# EAGLE design D1 Breakout - LCD SMD Dupont RJ45 Logo (EAGLE 7.3.0)
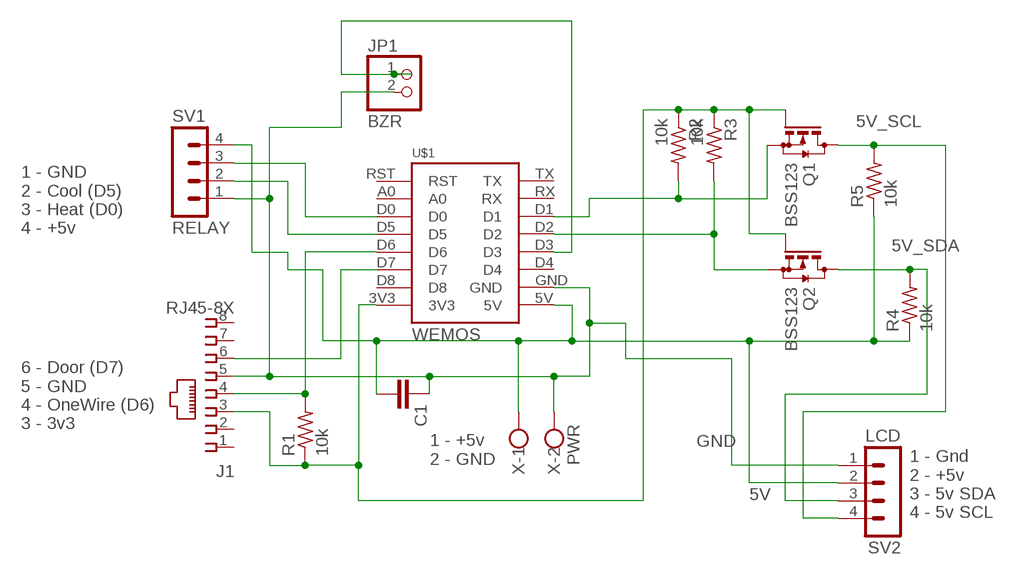
[diagram p0: schematic, sheet 1]

## Parts
C1  C-EUC1206  [C1206]
J1  RJ45-8X  [RJ45-NO-SHIELD-NOLINE]
JP1  BZR  PINHD-1X2  [1X02]
Q1  BSS123  [SOT23]
Q2  BSS123  [SOT23]
R1  10k  R-US_R0805  [R0805]
R2  10k  R-US_R0805  [R0805]
R3  10k  R-US_R0805  [R0805]
R4  10k  R-US_R0805  [R0805]
R5  10k  R-US_R0805  [R0805]
SV1  RELAY  MA04-1  [MA04-1]
SV2  LCD  MA04-1  [MA04-1]
U$1  WEMOS  [WEMOS]
X  PWR  W237-102  [W237-102]

## Nets
3V3_SCL: Q1.2(S) R2.2 U$1.D1
3V3_SDA: Q2.2(S) R3.2 U$1.D2
5V [5v]: C1.2 R4.1 R5.1 SV1.4 SV2.2 U$1.5V X.1
5V_SCL: Q1.3(D) R5.2 SV2.4
5V_SDA: Q2.3(D) R4.2 SV2.3
D6: J1.4 R1.2 U$1.D6
D7: J1.6 U$1.D7
GND [Gnd]: C1.1 J1.5 JP1.2 SV1.1 SV2.1 U$1.GND X.2
N$3 [3v]: J1.3 Q1.1(G) Q2.1(G) R1.1 R2.1 R3.1 U$1.3V3
N$6: JP1.1 U$1.D3
N$7: SV1.2 U$1.D5
N$8: SV1.3 U$1.D0
Unconnected: J1.1 J1.2 J1.7 J1.8 U$1.A0 U$1.D4 U$1.D8 U$1.RST U$1.RX U$1.TX

## Notes on the sheet
- 1 - GND
  2 - Cool (D5)
  3 - Heat (D0)
  4 - +5v
- 6 - Door (D7)
  5 - GND
  4 - OneWire (D6) 
  3 - 3v3
- 1 - +5v
  2 - GND
- 1 - Gnd
  2 - +5v
  3 - 5v SDA
  4 - 5v SCL

## Library data of the parts
C1 = resistor:C-EU: CAPACITOR, European symbol
J1 = con-tycoelectronics:RJ45: CORCOM Modular RJ Jacks No Shield Source: www.tycoelectronics.com .. ENG_DS_1654001_1099_RJ_L_0507.pdf; MPN: RJ45-8X; OC_FARNELL: unknown; OC_NEWARK: 16R6101
JP1 = pinhead:PINHD-1X2: PIN HEADER
Q1 Q2 = transistor-small-signal:BSS123: N-CHANNEL MOS FET
R1-R5 = rcl:R-US_: RESISTOR, American symbol
SV1 SV2 = con-lstb:MA04-1: PIN HEADER; OC_FARNELL: unknown; OC_NEWARK: unknown
U$1 = 1455413453956-wemos:WEMOS
X = con-wago-500:W237-102: WAGO SCREW CLAMP; MPN: 237-102; OC_FARNELL: unknown; OC_NEWARK: 70K9898

## Net classes
0 default: width 0.305 mm, clearance 0.305 mm
1 5v: width 0.406 mm, clearance 0.406 mm
2 3v: width 0.406 mm, clearance 0.406 mm
3 Gnd: width 0.406 mm, clearance 0.406 mm

## Board
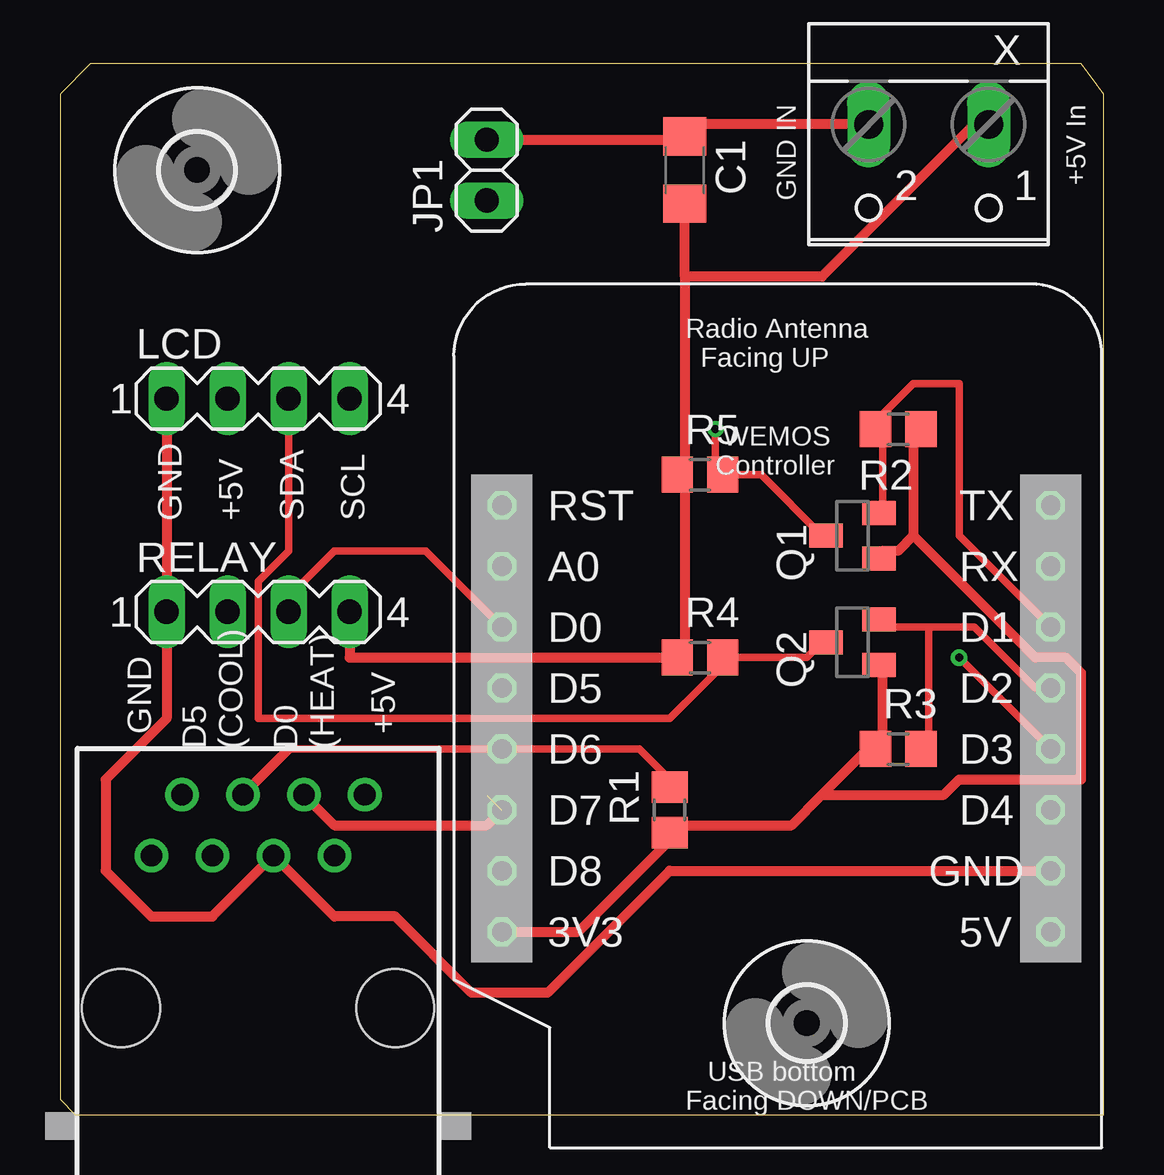
[diagram p1: board, top side]
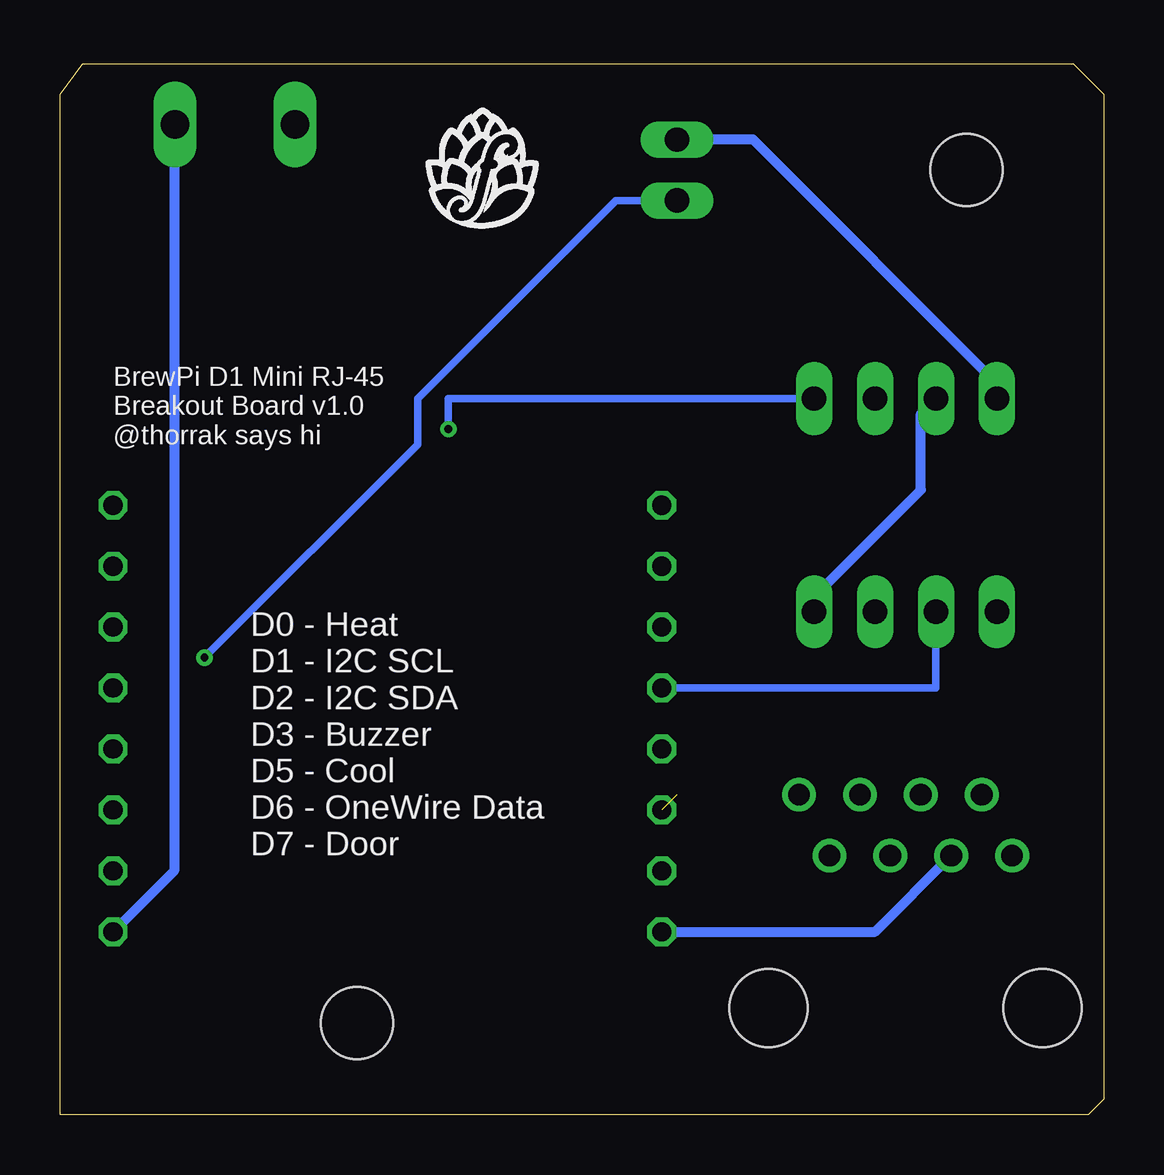
[diagram p2: board, bottom side, seen from below]

Size 43.48 x 43.81 mm. Coordinates in mm from the lower left corner, seen from the top.
Outline: 0,0.63 0.63,0 43.48,0 43.48,42.53 42.54,43.8 41.27,43.81 1.27,43.81 0,42.53 0,0.63
Copper layers (1*16): Top 0.0356mm / dielectric 1.5011mm / Bottom 0.0356mm
Design rules "PCBs_io": minimum track width 6mil, minimum drill 13mil, track to track 6mil, track to pad 6mil, pad to pad 6mil, via to via 6mil, smd to smd 6mil, copper to edge 15mil, drill to drill 6mil, minimum pad ring 7mil, minimum via ring 7mil, stop-mask expansion 3mil, vias tented up to drill 0mil, thermal gap 10mil

### Footprints (pad centres in the part's own frame; a part is rotated, then mirrored left to right if it is on the bottom)
C1206 = smd 1.6 x 1.8: 1 -1.4,0; 2 1.4,0
RJ45-NO-SHIELD-NOLINE = drill 0.9 pad 1.4: 1 -4.445,6.35; 2 -3.175,8.89; 3 -1.905,6.35; 4 -0.635,8.89; 5 0.635,6.35; 6 1.905,8.89; 7 3.175,6.35; 8 4.445,8.89 | hole 3.251: -5.715,0; 5.715,0
1X02 = drill 1.016 long: 1 -1.27,0; 2 1.27,0
SOT23 = smd 1 x 1.4: 1 -0.95,-1.1; 2 0.95,-1.1; 3 0,1.1
R0805 = smd 1.3 x 1.5: 1 -0.95,0; 2 0.95,0
MA04-1 = drill 1.016 long: 1 -3.81,0; 2 -1.27,0; 3 1.27,0; 4 3.81,0
WEMOS = drill 0.8 octagon: 3V3 0,0; 5V 22.86,0; A0 0,15.24; D0 0,12.7; D1 22.86,12.7; D2 22.86,10.16; D3 22.86,7.62; D4 22.86,5.08; D5 0,10.16; D6 0,7.62; D7 0,5.08; D8 0,2.54; GND 22.86,2.54; RST 0,17.78; RX 22.86,15.24; TX 22.86,17.78
3,0 = hole 3: 0,0
W237-102 = drill 1.194 long: 1 -2.5,-1.27; 2 2.5,-1.27

### Placement (x,y rotation side)
C1  26.04,39.37 270 top
J1  8.25,4.44 0 top
JP1  17.78,39.37 90 top
Q1  33.02,24.13 90 top
Q2  33.02,19.68 90 top
R1  25.4,12.7 90 top
R2  34.93,28.57 180 top
R3  34.93,15.24 0 top
R4  26.67,19.05 0 top
R5  26.67,26.67 0 top
SV1  8.25,20.96 0 top
SV2  8.25,29.85 0 top
U$1  18.41,7.62 0 top
U$2  [3,0]  5.71,39.37 0 top
U$4  [3,0]  31.12,3.81 0 top
X  36.2,40 180 top

### Tracks (layer width: path | path; a pad name or v marks a point on that pad's centre or on a via)
3V3_SCL
  Top 0.305: Q1.2 34.29,25.4 34.29,28.57 R2.2 33.65,28.57 35.56,30.48 37.46,30.48 37.46,24.13 U$1.D1
3V3_SDA
  Top 0.305: 36.2,20.32 38.1,20.32 40.64,17.78 U$1.D2 | 36.2,20.32 34.29,20.32 Q2.2 | 36.2,20.32 36.2,15.24 R3.2
5V
  Top 0.406: 26.04,26.67 26.04,19.05 R4.1 12.06,19.05 SV1.4 | 26.04,34.92 26.04,26.67 | 26.04,34.92 31.75,34.92 38.1,41.27 X.1 | 26.04,26.67 R5.1 | 26.04,34.92 C1.2
  Bottom 0.406: SV2.2 7.62,29.21 7.62,26.04 12.06,21.59 SV1.4 | U$1.5V 38.73,10.16 38.73,41.27 X.1
5V_SCL  (via drill 0.33)
  Top 0.305: Q1.3 31.75,24.13 29.21,26.67 R5.2 27.3,26.67 v27.3,28.57
  Bottom 0.305: SV2.4 27.3,29.85 v27.3,28.57
5V_SDA
  Top 0.305: 27.94,19.05 31.12,19.05 31.75,19.68 Q2.3 | SV2.3 9.52,23.5 8.25,22.22 8.25,16.51 25.4,16.51 27.94,19.05 | 27.94,19.05 R4.2
D6
  Top 0.305: R1.2 25.4,13.97 24.13,15.24 U$1.D6 9.52,15.24
  Top 0.406: J1.4 9.52,15.24
D7  (1 unrouted)
  Top 0.406: J1.6 11.43,12.07 17.78,12.07 U$1.D7
GND
  Top 0.406: X.2 26.04,41.27 C1.1 26.04,40.64 JP1.2 | SV2.1 SV1.1 4.45,16.51 1.9,13.97 1.9,10.16 3.81,8.25 6.35,8.25 J1.5 11.43,8.25 13.97,8.25 17.14,5.08 20.32,5.08 25.4,10.16 U$1.GND
  Bottom 0.406: SV2.1 4.45,30.48 14.6,40.64 JP1.2
N$3
  Top 0.406: 35.56,24.13 34.93,23.5 34.29,23.5 Q1.1 | 35.56,24.13 35.56,28.57 R2.1 | Q2.1 34.29,18.42 34.29,15.24 R3.1 33.65,15.24 31.75,13.33 | U$1.3V3 21.59,7.62 25.4,11.43 R1.1 25.4,12.07 30.48,12.07 31.75,13.33 | 35.56,24.13 40.64,19.05 41.91,19.05 42.54,18.42 42.54,13.97 37.46,13.97 36.83,13.33 31.75,13.33
  Bottom 0.406: U$1.3V3 9.52,7.62 J1.3
N$6  (via drill 0.33)
  Top 0.305: v37.46,19.05 U$1.D3
  Bottom 0.305: v37.46,19.05 28.57,27.94 28.57,29.85 20.32,38.1 JP1.1
N$7
  Bottom 0.305: U$1.D5 6.98,17.78 SV1.2
N$8
  Top 0.305: U$1.D0 15.24,23.5 11.43,23.5 9.52,21.59 SV1.3

### Text on the board
tPlace: GND IN | +5V In | GND | +5V | SDA | SCL | GND | D5 / (COOL) | D0 / (HEAT) | +5V
bNames: BrewPi D1 Mini RJ-45 / Breakout Board v1.0 / @thorrak says hi | D0 - Heat / D1 - I2C SCL / D2 - I2C SDA / D3 - Buzzer / D5 - Cool / D6 - OneWire Data / D7 - Door